# Altium schematic sheet S06.SchDoc: IEEE-1394/Ethernet FPGA Controller
size 381 x 254 mm; Revision: 2.1; SheetNumber: 6; SheetTotal: 6
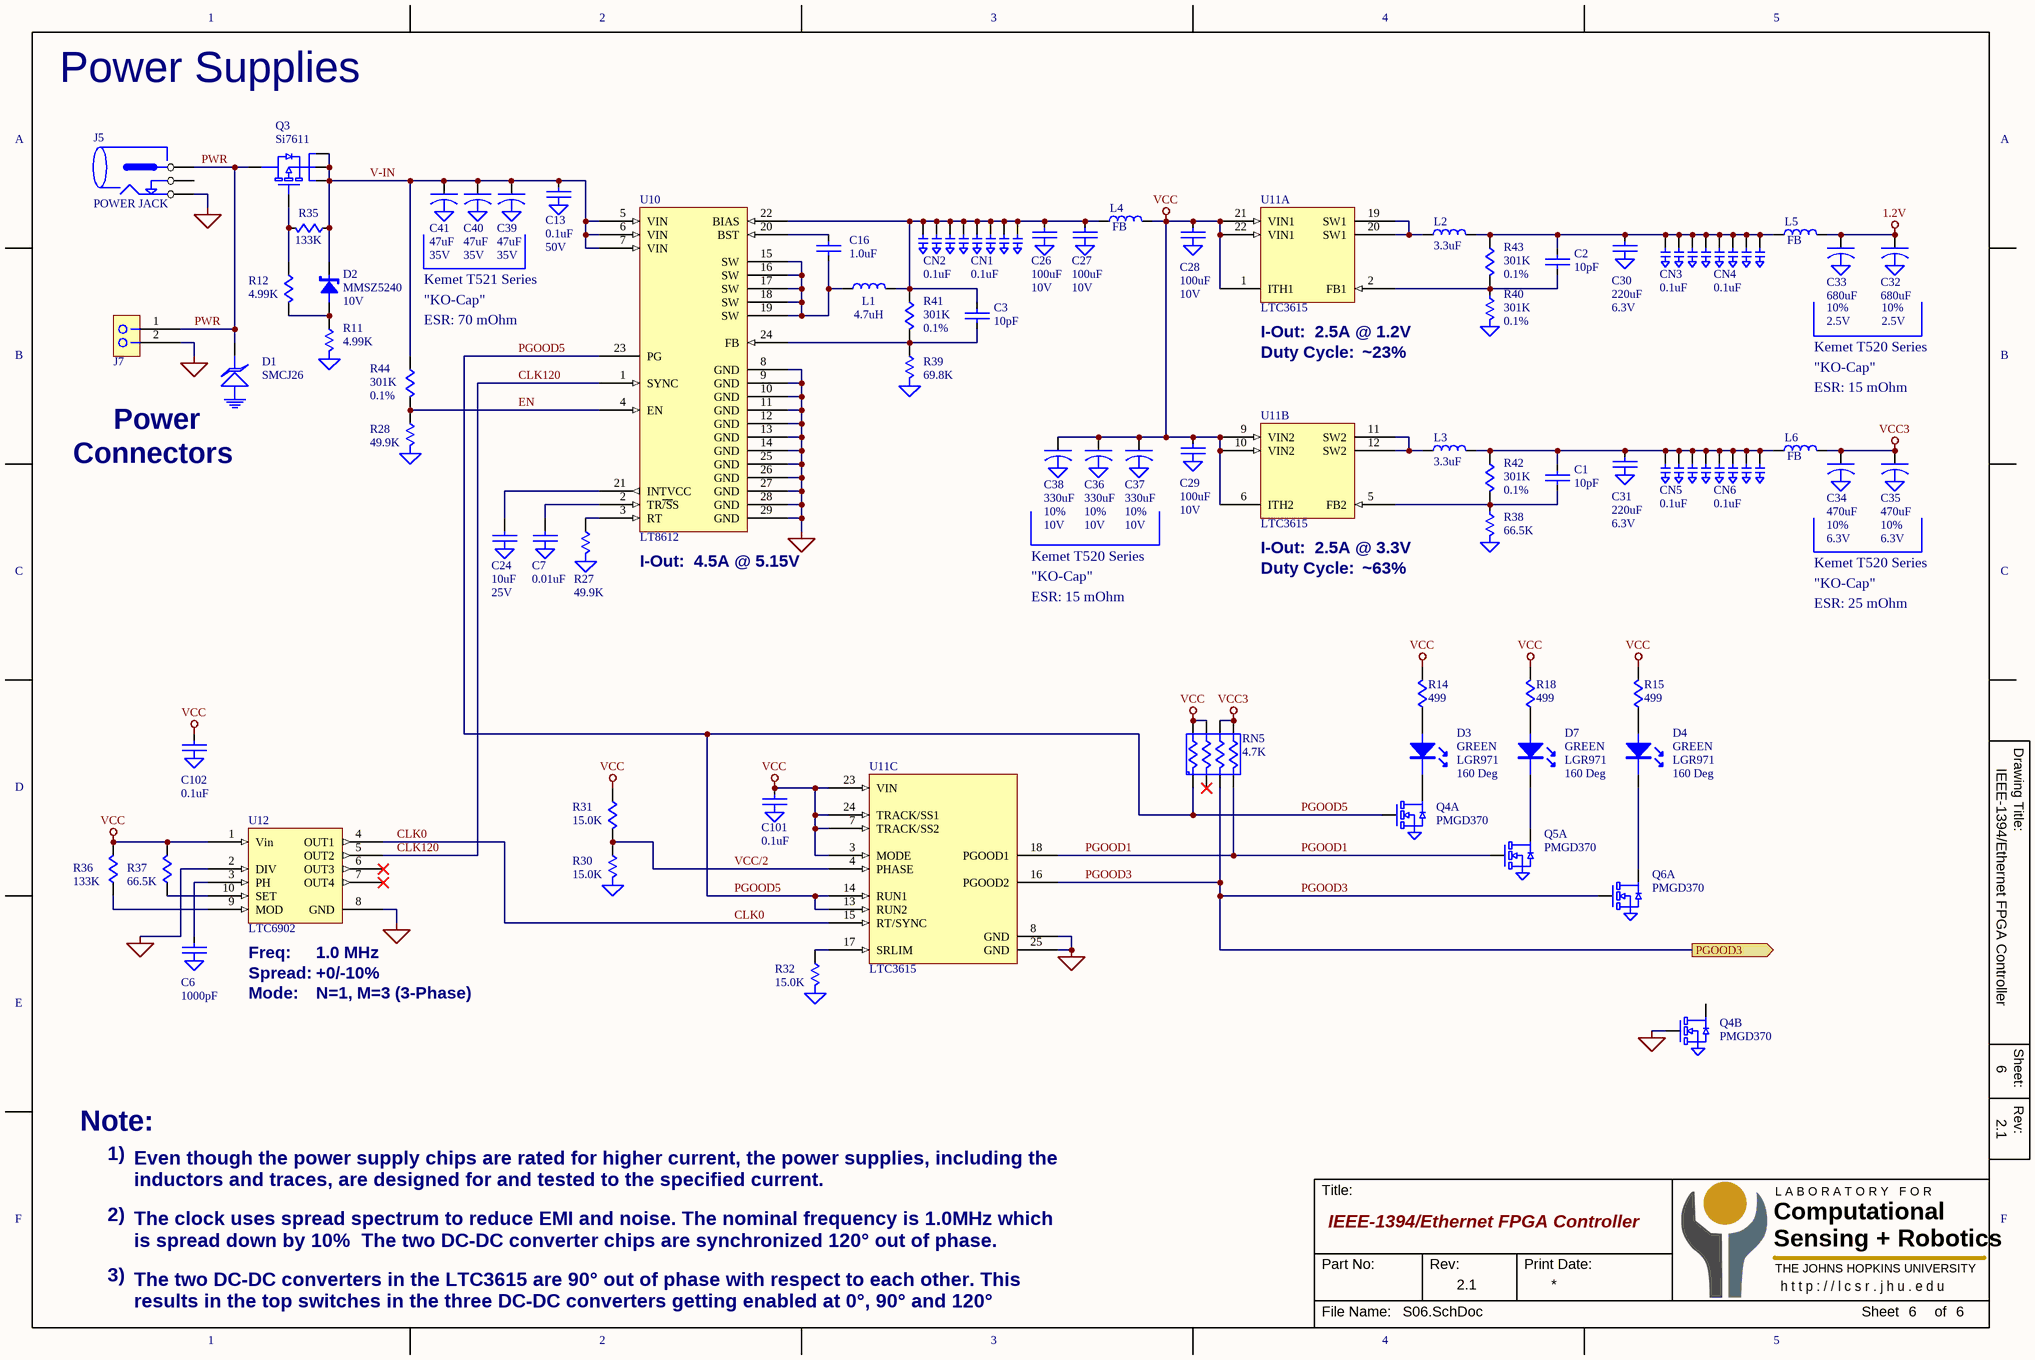
[diagram p0: S06.SchDoc]

## Parts
C1  10pF  [C0603]
C2  10pF  [C0603]
C3  10pF  [C0603]
C6  1000pF  [C0603]
C7  0.01uF  [C0603]
C13  0.1uF  Voltage: 50V  [C0603]
C16  1.0uF  [C0603]
C24  10uF  [C0805]
C26  100uF  Voltage: 10V  [C1210]
C27  100uF  Voltage: 10V  [C1210]
C28  100uF  [C1210]
C29  100uF  [C1210]
C30  220uF  Voltage: 6.3V  [C1210]
C31  220uF  Voltage: 6.3V  [C1210]
C32  680uF  Voltage: 2.5V  Tol: 10%  [CAP-D-31]
C33  680uF  Voltage: 2.5V  Tol: 10%  [CAP-D-31]
C34  470uF  Voltage: 6.3V  Tol: 10%  [CAP-D-31]
C35  470uF  Voltage: 6.3V  Tol: 10%  [CAP-D-31]
C36  330uF  Voltage: 10V  Tol: 10%  [CAP-D-31]
C37  330uF  Voltage: 10V  Tol: 10%  [CAP-D-31]
C38  330uF  Voltage: 10V  Tol: 10%  [CAP-D-31]
C39  47uF  Voltage: 35V  [CAP-D-31]
C40  47uF  Voltage: 35V  [CAP-D-31]
C41  47uF  Voltage: 35V  [CAP-D-31]
C101  0.1uF  [C0402]
C102  0.1uF  [C0402]
CN1  0.1uF  [CN0805]
CN2  0.1uF  [CN0805]
CN3  0.1uF  [CN0805]
CN4  0.1uF  [CN0805]
CN5  0.1uF  [CN0805]
CN6  0.1uF  [CN0805]
D1  SMCJ26  [DIODE-SMC]
D2  MMSZ5240  [SOD-323]
D3  Color: GREEN  P/N: LGR971  Angle: 160 Deg  [LED-0805]  (hidden comment: LED)
D4  Color: GREEN  P/N: LGR971  Angle: 160 Deg  [LED-0805]  (hidden comment: LED)
D7  Color: GREEN  P/N: LGR971  Angle: 160 Deg  [LED-0805]  (hidden comment: LED)
J5  POWER JACK  [RAPC712]
J7  HEADER 2  [HDR-2x1-100]  (value not drawn)
L1  4.7uH  [INDUCTOR-XAL7030]
L2  3.3uF  [INDUCTOR-XAL4040]
L3  3.3uF  [INDUCTOR-XAL4040]
L4  FB  [R1206]
L5  FB  [R1206]
L6  FB  [R1206]
Q3  Si7611  [PowerPak-1212]
Q4  PMGD370  [SC70-6]  (parts A,B of 2)
Q5  PMGD370  [SC70-6]  (part A of 2)
Q6  PMGD370  [SC70-6]  (part A of 2)
R11  4.99K  [R0603]
R12  4.99K  [R0603]
R14  499  [R0603]
R15  499  [R0603]
R18  499  [R0603]
R27  49.9K  [R0603]
R28  49.9K  [R0603]
R30  15.0K  [R0603]
R31  15.0K  [R0603]
R32  15.0K  [R0603]
R35  133K  [R0603]
R36  133K  [R0603]
R37  66.5K  [R0603]
R38  66.5K  [R0603]
R39  69.8K  [R0603]
R40  301K  [R0603]
R41  301K  [R0603]
R42  301K  [R0603]
R43  301K  [R0603]
R44  301K  [R0603]
RN5  4.7K  [RN-742C083]
U10  LT8612  [QFN-28-3x6mm]
U11  LTC3615  [QFN-24-4mm]  (parts A,B,C of 3)
U12  LTC6902  [MSOP-10]

## Ports
PGOOD3 (out)

## Nets
1.2V: C32.1 C33.1 L5.2
GND: C6.2(GND) C7.2(GND) C13.2(GND) C24.2(GND) C26.2(GND) C27.2(GND) C28.2(GND) C29.2(GND) C30.2(GND) C31.2(GND) C32.2(GND) C33.2(GND) C34.2(GND) C35.2(GND) C36.2(GND) C37.2(GND) C38.2(GND) C39.2(GND) C40.2(GND) C41.2(GND) C101.2(GND) C102.2(GND) CN1.1(GND) CN1.2(GND) CN1.3(GND) CN1.4(GND) CN2.1(GND) CN2.2(GND) CN2.3(GND) CN2.4(GND) CN3.1(GND) CN3.2(GND) CN3.3(GND) CN3.4(GND) CN4.1(GND) CN4.2(GND) CN4.3(GND) CN4.4(GND) CN5.1(GND) CN5.2(GND) CN5.3(GND) CN5.4(GND) CN6.1(GND) CN6.2(GND) CN6.3(GND) CN6.4(GND) D1.2(GND) J5.3 J7.2 Q4.1(S1) Q4.4(S2) Q4.5(G2) Q5.1(S1) Q6.1(S1) R11.2(GND) R27.2(GND) R28.2(GND) R30.2(GND) R32.2(GND) R38.2(GND) R39.2(GND) R40.2(GND) U10.8(GND) U10.9(GND) U10.10(GND) U10.11(GND) U10.12(GND) U10.13(GND) U10.14(GND) U10.25(GND) U10.26(GND) U10.27(GND) U10.28(GND) U10.29(GND) U11.8(GND) U11.25(GND) U12.2(DIV) U12.8(GND)
VCC: C28.1 C29.1 C36.1 C37.1 C38.1 C101.1 C102.1 L4.2 R14.2 R15.2 R18.2 R31.1 R36.2 R37.2 RN5.7(R2.2) RN5.8(R1.2) U11.1(ITH1) U11.3(MODE) U11.6(ITH2) U11.7(TRACK/SS2) U11.9(VIN2) U11.10(VIN2) U11.21(VIN1) U11.22(VIN1) U11.23(VIN) U11.24(TRACK/SS1) U12.1(Vin)
VCC3: C34.1 C35.1 L6.2 RN5.5(R4.2) RN5.6(R3.2)
CLK0: U11.15(RT/SYNC) U12.4(OUT1)
CLK120: U10.1(SYNC) U12.5(OUT2)
EN: R28.1 R44.2 U10.4(EN)
PGOOD1: Q5.2(G1) RN5.4(R4.1) U11.18(PGOOD1)
PGOOD3: Q6.2(G1) RN5.3(R3.1) U11.16(PGOOD2) ; port PGOOD3
PGOOD5: Q4.2(G1) RN5.1(R1) U10.23(PG) U11.13(RUN2) U11.14(RUN1)
PWR: D1.1 J5.1 J7.1 Q3.5(D)
V-IN: C13.1 C39.1 C40.1 C41.1 D2.1(C) Q3.1(S) Q3.2(S) Q3.3(S) R35.1 R44.1 U10.5(VIN) U10.6(VIN) U10.7(VIN)
VCC/2: R30.1 R31.2 U11.4(PHASE)
NetC1_1: C1.1 C31.1 CN5.5 CN5.6 CN5.7 CN5.8 CN6.5 CN6.6 CN6.7 CN6.8 L3.2 L6.1 R42.1
NetC1_2: C1.2 R38.1 R42.2 U11.5(FB2)
NetC2_1: C2.1 C30.1 CN3.5 CN3.6 CN3.7 CN3.8 CN4.5 CN4.6 CN4.7 CN4.8 L2.2 L5.1 R43.1
NetC2_2: C2.2 R40.1 R43.2 U11.2(FB1)
NetC3_1: C3.1 C26.1 C27.1 CN1.5 CN1.6 CN1.7 CN1.8 CN2.5 CN2.6 CN2.7 CN2.8 L1.2 L4.1 R41.1 U10.22(BIAS)
NetC3_2: C3.2 R39.1 R41.2 U10.24(FB)
NetC6_1: C6.1 U12.3(PH)
NetC7_1: C7.1 U10.2(TR~{/S}S)
NetC16_1: C16.1 U10.20(BST)
NetC16_2: C16.2 L1.1 U10.15(SW) U10.16(SW) U10.17(SW) U10.18(SW) U10.19(SW)
NetC24_1: C24.1 U10.21(INTVCC)
NetD2_2: D2.2(GND) R11.1 R12.2
NetD3_1: D3.1(C) Q4.6(D1)
NetD3_2: D3.2(A) R14.1
NetD4_1: D4.1(C) Q6.6(D1)
NetD4_2: D4.2(A) R15.1
NetD7_1: D7.1(C) Q5.6(D1)
NetD7_2: D7.2(A) R18.1
NetL2_1: L2.1 U11.19(SW1) U11.20(SW1)
NetL3_1: L3.1 U11.11(SW2) U11.12(SW2)
NetQ3_4: Q3.4(G) R12.1 R35.2
NetR27_1: R27.1 U10.3(RT)
NetR32_1: R32.1 U11.17(SRLIM)
NetR36_1: R36.1 U12.9(MOD)
NetR37_1: R37.1 U12.10(SET)

Not connected (* = marked no-connect by the designer): J5 2; Q4 3(D2); RN5 2(R2.1)*; U12 6(OUT3)* 7(OUT4)*

## Notes on the sheet
- Power Supplies
- Kemet T521 Series
- "KO-Cap"
- (near R44) ESR: 70 mOhm
- Duty Cycle:
- (near U11) I-Out:
- (near U11) 2.5A @ 1.2V
- ~23%
- Kemet T520 Series
- Power
- ESR: 15 mOhm
- Connectors
- (near U10) I-Out:
- (near U10) 4.5A @ 5.15V
- (near U11) 2.5A @ 3.3V
- ~63%
- ESR: 25 mOhm
- Freq:
- Spread:
- (near U12) 1.0 MHz
- +0/-10%
- Mode:
- N=1, M=3 (3-Phase)
- Note:
- 1)
- 2)
- Even though the power supply chips are rated for higher current, the power supplies, including the inductors and traces, are designed for and tested to the specified current.
- The clock uses spread spectrum to reduce EMI and noise. The nominal frequency is 1.0MHz which is spread down by 10%  The two DC-DC converter chips are synchronized 120° out of phase.
- 3)
- The two DC-DC converters in the LTC3615 are 90° out of phase with respect to each other. This results in the top switches in the three DC-DC converters getting enabled at 0°, 90° and 120°
- 1
- 2
- 3
- 4
- 5
- A
- B
- C
- Drawing Title:
- D
- E
- Sheet:
- Rev:
- F
- Title:
- Computational
- Sensing + Robotics
- L A B O R A T O R Y   F O R
- Part No:
- Print Date:
- THE JOHNS HOPKINS UNIVERSITY
- h t t p : / / l c s r . j h u . e d u
- File Name:
- Sheet
- of
- (in symbol CAP-GND) 25V; 10V
- (in symbol R) 0.1%
- (in symbol R-GND) 0.1%
- (in symbol ZENER) 10V

## Library data of the parts
C1-C3 C16 = CAP
C6 C7 C13 C24 C26-C31 C101 C102 = CAP-GND
C32-C35 = CAP-POL-GND: Type: KO-Cap
C36-C38 = CAP-POL-GND: Type: SpeedPower
C39-C41 = CAP-POL-GND: Type: Tant
CN1-CN6 = CN-GND
D1 = TVS-GND
D2 = ZENER
L1-L6 = INDUCTOR
Q3 = MOSFET-P-PPACK
Q4-Q6 = MOSFET-N-DUAL6
R11 R27 R28 R30 R32 R38-R40 = R-GND
R12 R14 R15 R18 R31 R35-R37 R41-R44 = R
RN5 = RN-DISC-SM-4